# EAGLE schematic powergig (EAGLE 6.6.0)
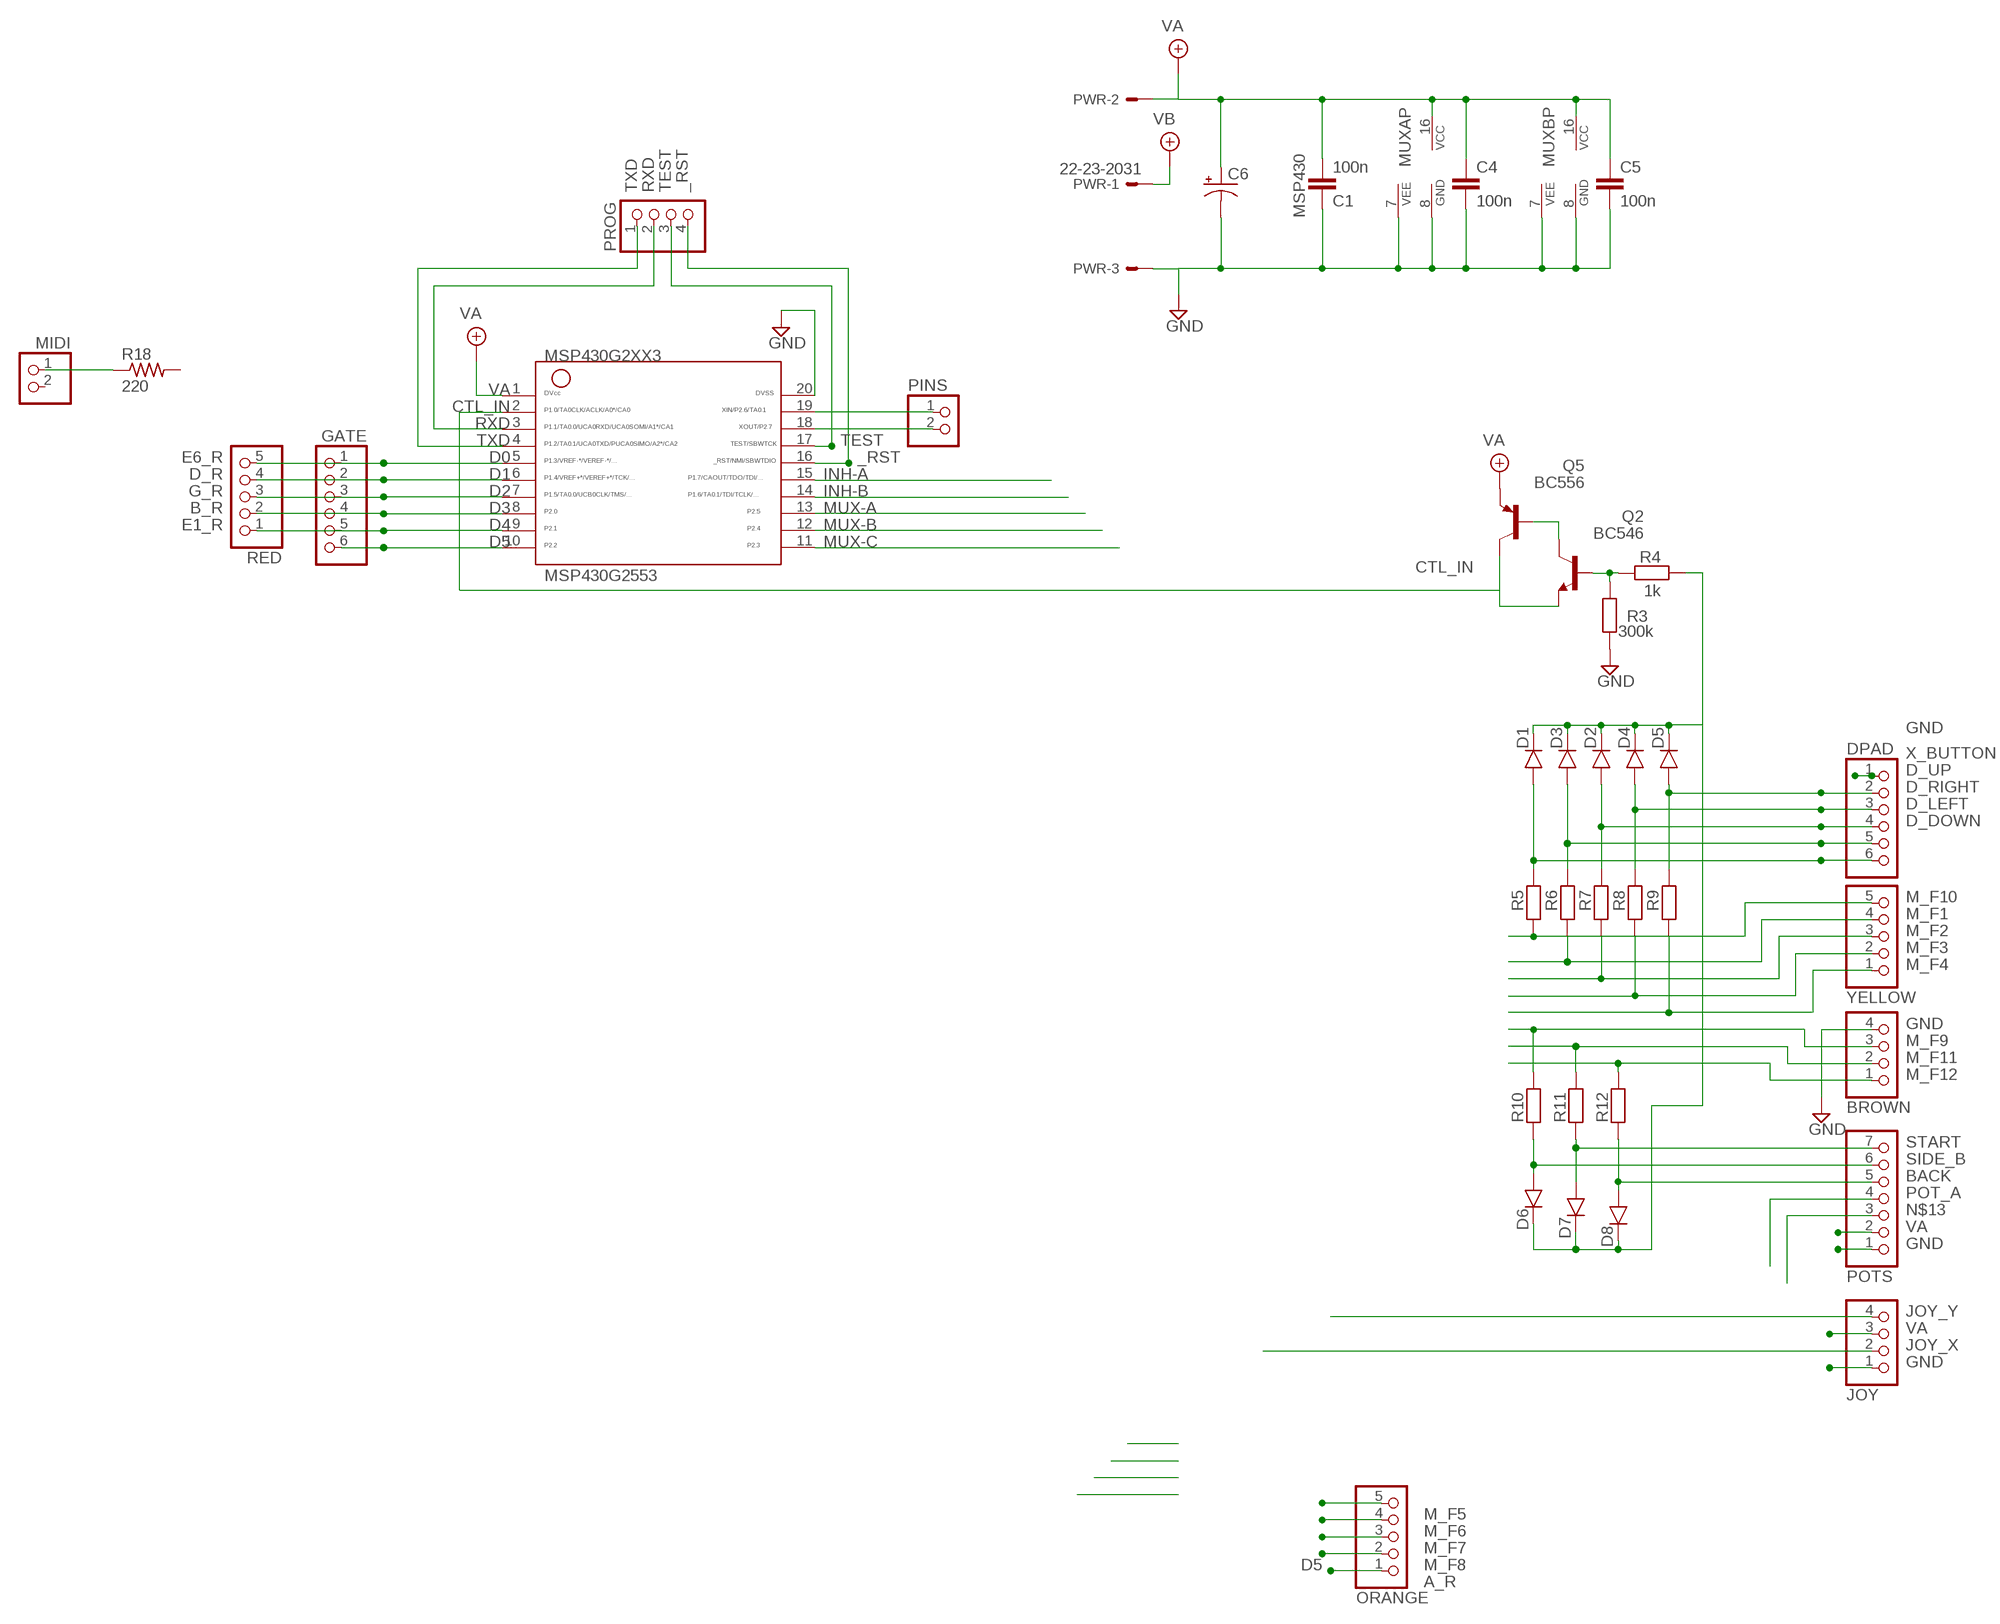
[diagram p0: schematic, sheet 1]

## Parts
BROWN  PINHD-1X4  [1X04]
C1  100n  050X030_050  [050X030_050_3]
C4  100n  050X030_0501  [050X030_050_1]
C5  100n  050X030_050  [050X030_050_3]
C6  0501  [050_020_1]
D1  1N4148-2  [DO35-2]
D2  1N4148-2  [DO35-2]
D3  1N4148-2  [DO35-2]
D4  1N4148-2  [DO35-2]
D5  1N4148-2  [DO35-2]
D6  1N4148-2  [DO35-2]
D7  1N4148-2  [DO35-2]
D8  1N4148-2  [DO35-2]
DPAD  PINHD-1X6  [1X06]
GATE  PINHD-1X6  [1X06]
JOY  PINHD-1X4  [1X04]
MIDI  PINHD-1X2  [1X02]
MSP430G2553  G2XX3---N20  [N20]
MUXA  4051N  [DIL16]
MUXB  4052N  [DIL16]
ORANGE  PINHD-1X5  [1X05]
PINS  PINHD-1X2  [1X02]
POTS  PINHD-1X7  [1X07]
PROG  PINHD-1X4  [1X04]
PWR  22-23-2031  [22-23-2031]
Q2  BC546  BC546B  [TO92-EBC]
Q5  BC556  [TO92-EBC]
R3  300k  6MM-EU1  [R0207/1V]
R4  1k  6MM-EU  [R0207/3]
R5  30k  6MM-EU1  [R0207/1V]
R6  30k  6MM-EU1  [R0207/1V]
R7  30k  6MM-EU1  [R0207/1V]
R8  30k  6MM-EU1  [R0207/1V]
R9  30k  6MM-EU1  [R0207/1V]
R10  30k  6MM-EU2  [R0207/2V]
R11  30k  6MM-EU2  [R0207/2V]
R12  30k  6MM-EU2  [R0207/2V]
R18  220  6MM.3  [R0207/3]
RED  PINHD-1X5  [1X05]
YELLOW  PINHD-1X5  [1X05]

## Nets
_RST: MSP430G2553.16 PROG.4
BACK: D7.A POTS.7 R11.2
CTL_IN: MSP430G2553.2 Q2.E Q5.C
D0: GATE.1 MSP430G2553.5 RED.5
D1: GATE.2 MSP430G2553.6 RED.4
D2: GATE.3 MSP430G2553.7 RED.3
D3: GATE.4 MSP430G2553.8 RED.2
D4: GATE.5 MSP430G2553.9 RED.1
D5: GATE.6 MSP430G2553.10 ORANGE.1
D_DOWN: D1.A DPAD.6 R5.2
D_LEFT: D3.A DPAD.5 R6.2
D_RIGHT: D2.A DPAD.4 R7.2
D_UP: D4.A DPAD.3 R8.2
GND: BROWN.4 C1.1 C4.2 C5.2 C6.- DPAD.1 JOY.1 MSP430G2553.20 MUXA.7(VEE) MUXA.8(GND) MUXB.7(VEE) MUXB.8(GND) POTS.1 PWR.3 R3.2
INH-A: MSP430G2553.15
INH-B: MSP430G2553.14
JOY_X: JOY.2
JOY_Y: JOY.4
M_F1: R6.1 YELLOW.4
M_F2: R7.1 YELLOW.3
M_F3: R8.1 YELLOW.2
M_F4: R9.1 YELLOW.1
M_F5: ORANGE.5
M_F6: ORANGE.4
M_F7: ORANGE.3
M_F8: ORANGE.2
M_F9: BROWN.3 R10.1
M_F10: R5.1 YELLOW.5
M_F11: BROWN.2 R11.1
M_F12: BROWN.1 R12.1
MUX-A: MSP430G2553.13
N$1: MIDI.1 R18.1
N$2: Q2.C Q5.B
N$5: Q2.B R3.1 R4.2
N$8: MSP430G2553.19 PINS.1
N$9: MSP430G2553.18 PINS.2
N$13: POTS.3
N$19: D1.C D2.C D3.C D4.C D5.C D6.C D7.C D8.C R4.1
POT_A: POTS.4
RXD: MSP430G2553.3 PROG.2
SIDE_B: D6.A POTS.6 R10.2
START: D8.A POTS.5 R12.2
TEST: MSP430G2553.17 PROG.3
TXD: MSP430G2553.4 PROG.1
VA: C1.2 C4.1 C5.1 C6.+ JOY.3 MSP430G2553.1 MUXA.16(VCC) MUXB.16(VCC) POTS.2 PWR.2 Q5.E
VB: PWR.1
X_BUTTON: D5.A DPAD.2 R9.2
Unconnected: MIDI.2 MSP430G2553.11 MSP430G2553.12 MUXA.1(X4) MUXA.2(X6) MUXA.3(X) MUXA.4(X7) MUXA.5(X5) MUXA.6(INH) MUXA.9(C) MUXA.10(B) MUXA.11(A) MUXA.12(X3) MUXA.13(X0) MUXA.14(X1) MUXA.15(X2) MUXB.1(Y0) MUXB.2(Y2) MUXB.3(Y) MUXB.4(Y3) MUXB.5(Y1) MUXB.6(INH) MUXB.9(B) MUXB.10(A) MUXB.11(X3) MUXB.12(X0) MUXB.13(X) MUXB.14(X1) MUXB.15(X2) R18.2

## Notes on the sheet
- MSP430
- E6_R
- D_R
- G_R
- B_R
- E1_R
- A_R

## Library data of the parts
BROWN JOY PROG = pinhead:PINHD-1X4: PIN HEADER
C1 C4 C5 = gm-caps-ceramic:050X030_050: 120 - 150pF Xicon Ceramic Disc 5mm lead spacing
C6 = gm-caps-electro-pol:050: 0.22 - 100uF Xicon values at Mouser.com: 10V: 10 - 100uF; 16V: 2.2 - 47uF; 25V: 0.47 - 47uF; 50V: 0.22 - 22uF
D1-D8 = gm-diodes:1N4148: Fast Switching Diode DO-35 glass case a.k.a. 1N914
DPAD GATE = pinhead:PINHD-1X6: PIN HEADER
MIDI PINS = pinhead:PINHD-1X2: PIN HEADER
MSP430G2553 = TI_MSP430_v16:G2XX3---N20: MSP430G2XX1 PDIP (N) 20 Pin Package
MUXA = 40xx:4051: 8-channel ANALOG MULTIPLEXER
MUXB = 40xx:4052: Dual 4-channel ANALOG MULTIPLEXER
ORANGE RED YELLOW = pinhead:PINHD-1X5: PIN HEADER
POTS = pinhead:PINHD-1X7: PIN HEADER
PWR = jaapie:22-23-2031: .100" (2.54mm) Center Header - 3 Pin; MF: MOLEX; MPN: 22-23-2031; OC_FARNELL: 1462950; OC_NEWARK: 30C0862
Q2 = transistor-npn:BC546*: NPN Transistor
Q5 = transistor-pnp:BC556*: PNP Transistror
R3-R12 = gm-resistors:6MM-EU: 6mm Resistors (European schematic symbol) Leads spaced 1-6 holes apart for 0.1" perfboard. Suitable for 1/4 watt resistors.
R18 = gm-resistors:6MM: 6mm Resistors Leads spaced 1-6 holes apart for 0.1" perfboard. Suitable for 1/4 watt resistors.